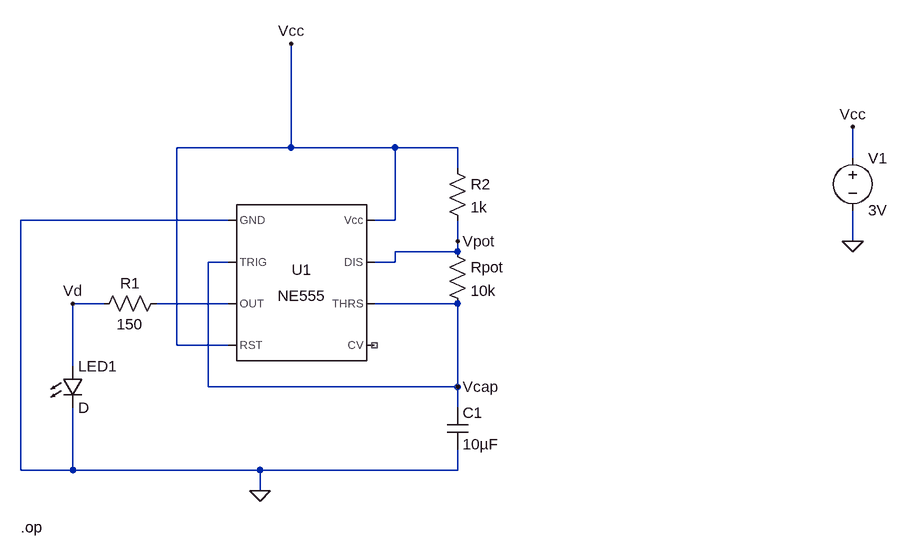
[diagram p0: schematic Mercer Soldering Demo Board.asc]
Mercer Soldering Demo Board.asc, the LTspice schematic file:
Version 4
SHEET 1 1128 680
WIRE 208 -32 208 -192
WIRE 208 -32 32 -32
WIRE 368 -32 208 -32
WIRE 464 -32 368 -32
WIRE 1072 -16 1072 -64
WIRE 464 0 464 -32
WIRE 112 80 -208 80
WIRE 368 80 368 -32
WIRE 368 80 336 80
WIRE 464 112 464 80
WIRE 1072 112 1072 64
WIRE 464 128 464 112
WIRE 464 128 368 128
WIRE 112 144 80 144
WIRE 368 144 368 128
WIRE 368 144 336 144
WIRE -80 208 -128 208
WIRE 112 208 0 208
WIRE 464 208 336 208
WIRE 32 272 32 -32
WIRE 112 272 32 272
WIRE -128 304 -128 208
WIRE 80 336 80 144
WIRE 464 336 464 208
WIRE 464 336 80 336
WIRE 464 368 464 336
WIRE -208 464 -208 80
WIRE -128 464 -128 368
WIRE -128 464 -208 464
WIRE 160 464 -128 464
WIRE 464 464 464 432
WIRE 464 464 160 464
WIRE 160 496 160 464
FLAG 208 -192 Vcc
FLAG 1072 112 0
FLAG 1072 -64 Vcc
FLAG 160 496 0
FLAG -128 208 Vd
FLAG 464 336 Vcap
FLAG 464 112 Vpot
SYMBOL Misc\\NE555 224 176 R0
SYMATTR InstName U1
SYMBOL LED -144 304 R0
SYMATTR InstName LED1
SYMBOL voltage 1072 -32 R0
WINDOW 123 0 0 Left 0
WINDOW 39 0 0 Left 0
SYMATTR InstName V1
SYMATTR Value 3V
SYMBOL res 16 192 R90
WINDOW 0 0 56 VBottom 2
WINDOW 3 32 56 VTop 2
SYMATTR InstName R1
SYMATTR Value 150
SYMBOL res 448 -16 R0
SYMATTR InstName R2
SYMATTR Value 1k
SYMBOL cap 448 368 R0
SYMATTR InstName C1
SYMATTR Value 10µF
SYMBOL res 448 112 R0
SYMATTR InstName Rpot
SYMATTR Value 10k
TEXT -208 552 Left 2 !.op

The netlist it stands for:
* Mercer Soldering Demo Board.asc
XU1 0 Vcap N001 Vcc NC_01 Vcap Vpot Vcc NE555  ; pins GND TRIG OUT RST CV THRS DIS Vcc
D§LED1 Vd 0 D
V1 Vcc 0 3V
R1 N001 Vd 150
R2 Vcc Vpot 1k
C1 Vcap 0 10µF
Rpot Vpot Vcap 10k
.model D D
.lib standard.dio
.op
.lib NE555.sub
.backanno
.end